# EAGLE design 44780_LCD-v1 (EAGLE 5.07)
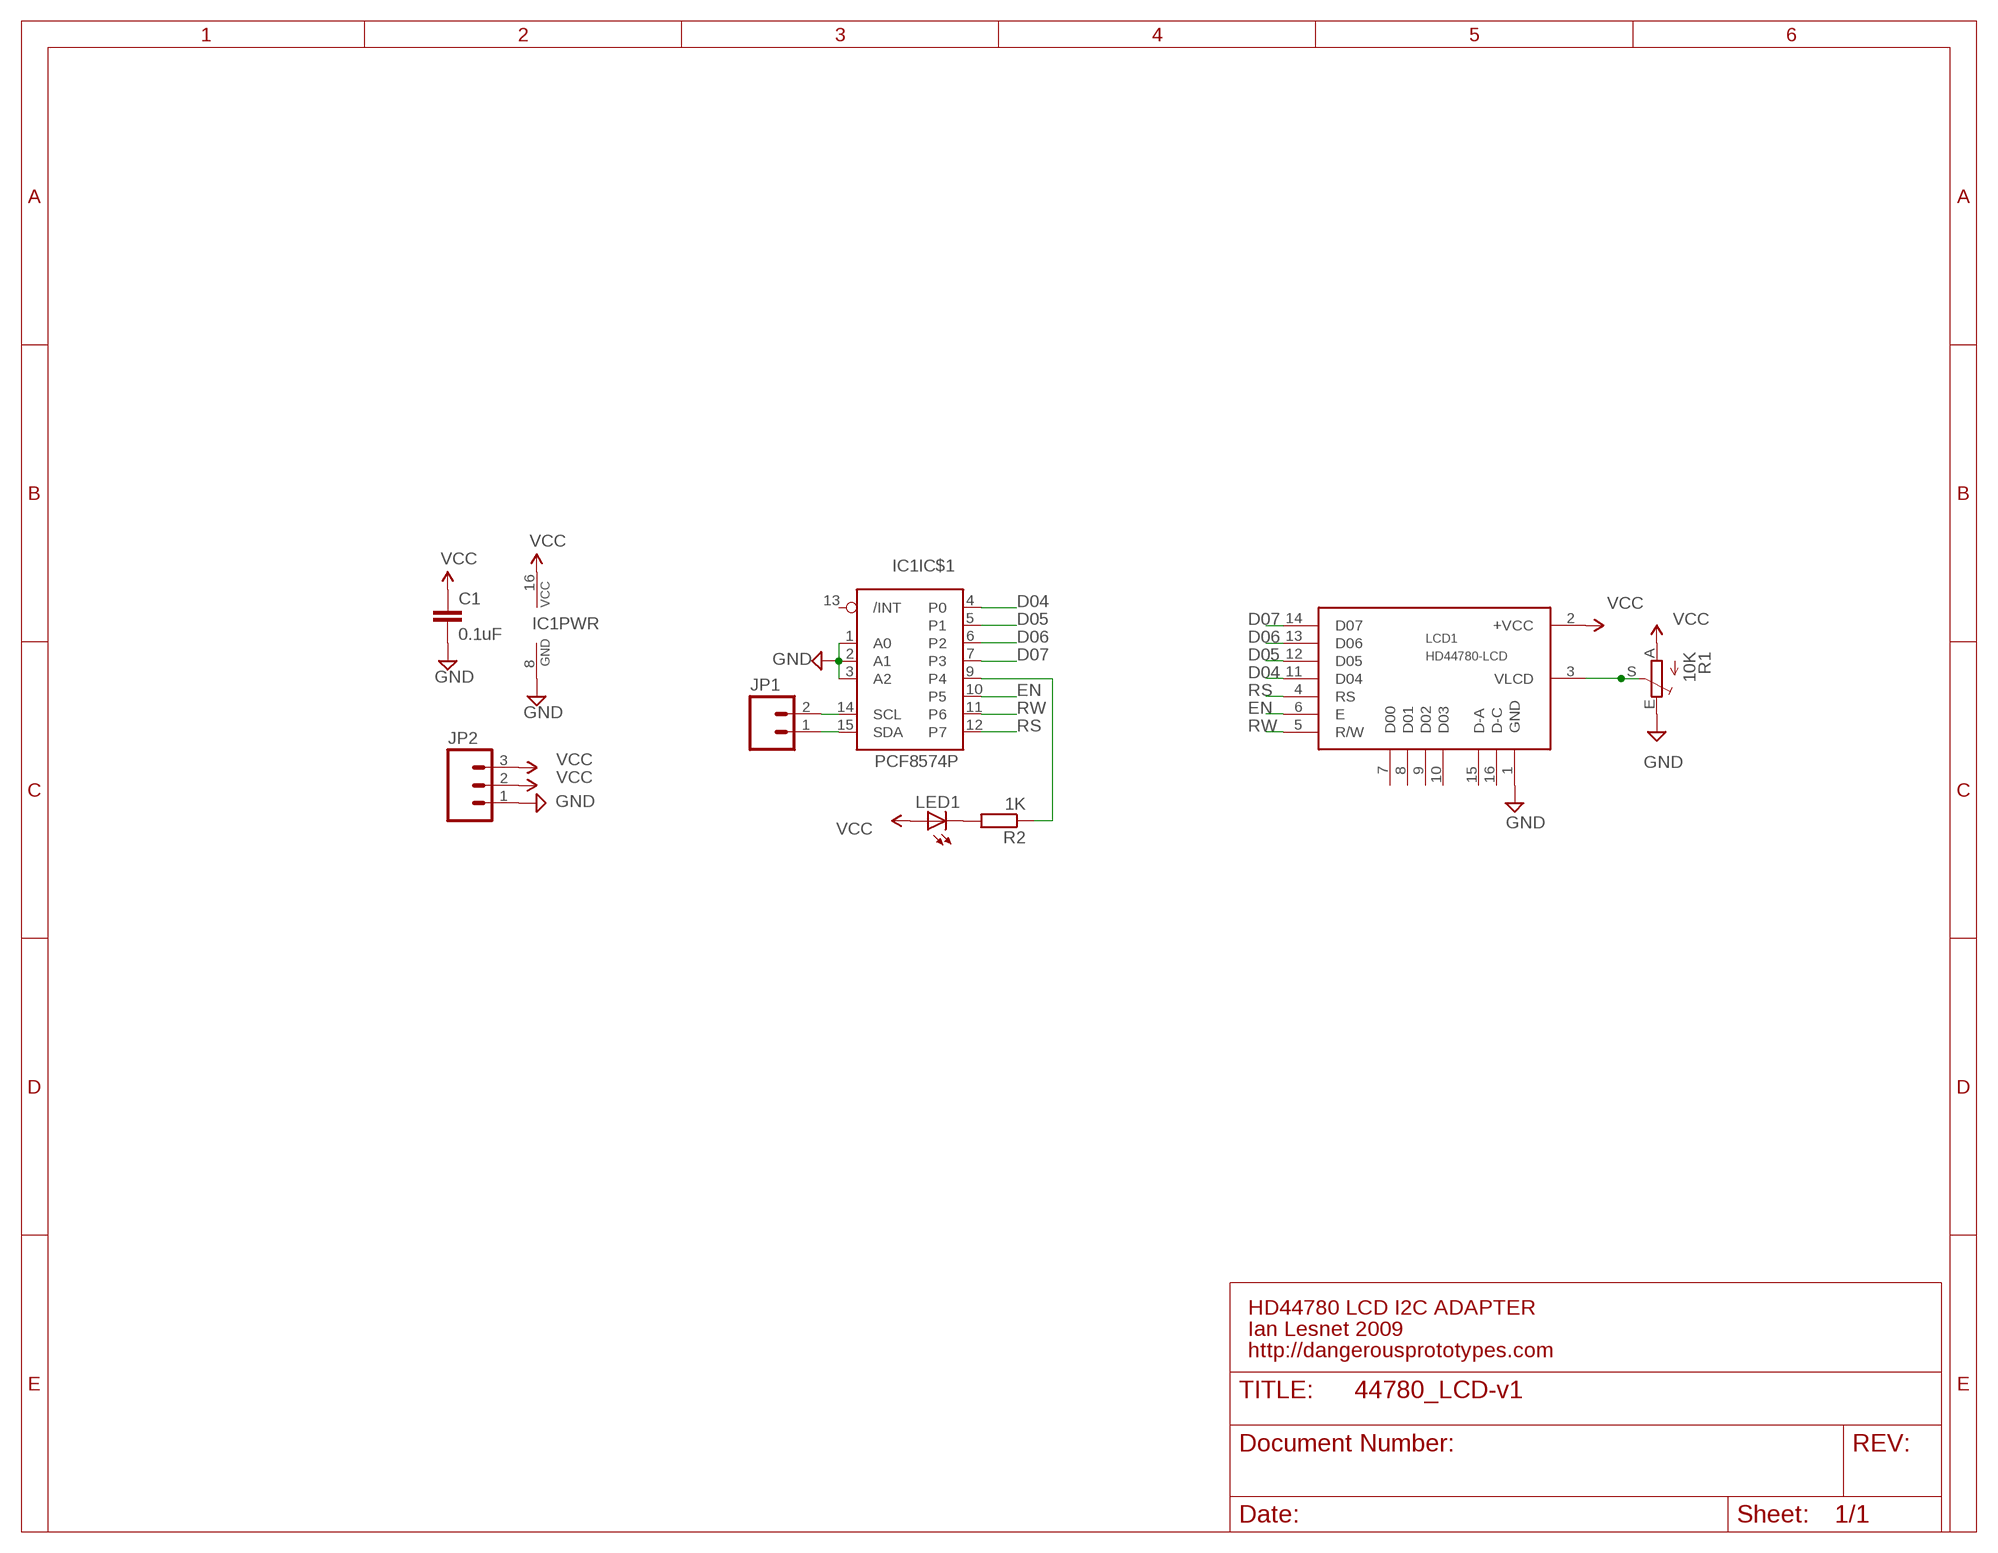
[diagram p0: schematic, sheet 1]

## Parts
C1  0.1uF  C-EU025-024X044  [C025-024X044]
IC1  PCF8574P  [DIL16]
JP1  M02PTH  [1X02]
JP2  M03PTH  [1X03]
LCD1  HD44780-LCD  [HD44780]
LED1  LED3MM  [LED3MM]
R1  10K  TRIM_EU-CA6V  [CA6V]
R2  1K  R-EU_0204/7  [0204/7]

## Nets
D04: IC1.4(IC$1:P0) LCD1.11(D04)
D05: IC1.5(IC$1:P1) LCD1.12(D05)
D06: IC1.6(IC$1:P2) LCD1.13(D06)
D07: IC1.7(IC$1:P3) LCD1.14(D07)
EN: IC1.10(IC$1:P5) LCD1.6(E)
GND: C1.2 IC1.1(IC$1:A0) IC1.2(IC$1:A1) IC1.3(IC$1:A2) IC1.8(PWR:GND) JP2.1 LCD1.1(GND) R1.E
N$8: IC1.14(IC$1:SCL) JP1.2
N$9: IC1.15(IC$1:SDA) JP1.1
N$10: LCD1.3(VLCD) R1.S
N$12: LED1.K(C) R2.2
N$13: IC1.9(IC$1:P4) R2.1
RS: IC1.12(IC$1:P7) LCD1.4(RS)
RW: IC1.11(IC$1:P6) LCD1.5(R/W)
VCC: C1.1 IC1.16(PWR:VCC) JP2.2 JP2.3 LCD1.2(+VCC) LED1.A R1.A
Unconnected: IC1.13(IC$1:/INT) LCD1.7(D00) LCD1.8(D01) LCD1.9(D02) LCD1.10(D03) LCD1.15(D-A) LCD1.16(D-C)

## Notes on the sheet
- HD44780 LCD I2C ADAPTER
- Ian Lesnet 2009
- http://dangerousprototypes.com

## Library data of the parts
C1 = rcl:C-EU: CAPACITOR, European symbol
IC1 = i2c:PCF8574: Remote 8-Bit I/O Expander for I²C Bus
JP1 = SparkFun:M02: Header 2 Standard 2-pin 0.1" header. Use with straight break away headers (SKU : PRT-00116), right angle break away headers (PRT-00553), swiss pins (PRT-00743), machine pins (PRT-00117), and female headers (PRT-00115). Molex polarized connector foot print use with SKU : PRT-08233 with associated crimp pins and housings.
JP2 = SparkFun:M03: Header 3 Standard 3-pin 0.1" header. Use with straight break away headers (SKU : PRT-00116), right angle break away headers (PRT-00553), swiss pins (PRT-00743), machine pins (PRT-00117), and female headers (PRT-00115). Molex polarized connector foot print use with SKU : PRT-08232 with associated crimp pins and housings.
LCD1 = lcd-hd44780:HD44780-LCD
LED1 = led:LED: LED OSRAM: - CHIPLED LG R971, LG N971, LY N971, LG Q971, LY Q971, LO R971, LY R971 LH N974, LH R974 LS Q976, LO Q976, LY Q976 LO Q996 - Hyper CHIPLED LW Q18S LB Q993, LB Q99A, LB R99A - SideLED LS A670, LO A670, LY A670, LG A670, LP A670 LB A673, LV A673, LT A673, LW A673 LH A674 LY A675 LS A676, LA A676, LO A676, LY A676, LW A676 LS A679, LY A679, LG A679 - Hyper Micro SIDELED® LS Y876, LA Y876, LO Y876, LY Y876 LT Y87S - SmartLED LW L88C, LW L88S LB L89C, LB L89S, LG L890 LS L89K, LO L89K, LY L89K LS L896, LA L896, LO L896, LY L896 - TOPLED LS T670, LO T670, LY T670, LG T670, LP T670 LSG T670, LSP T670, LSY T670, LOP T670, LYG T670 LG T671, LOG T671, LSG T671 LB T673, LV T673, LT T673, LW T673 LH T674 LS T676, LA T676, LO T676, LY T676, LB T676, LH T676, LSB T676, LW T676 LB T67C, LV T67C, LT T67C, LS T67K, LO T67K, LY T67K, LW E67C LS E67B, LA E67B, LO E67B, LY E67B, LB E67C, LV E67C, LT E67C LW T67C LS T679, LY T679, LG T679 LS T770, LO T770, LY T770, LG T770, LP T770 LB T773, LV T773, LT T773, LW T773 LH T774 LS E675, LA E675, LY E675, LS T675 LS T776, LA T776, LO T776, LY T776, LB T776 LHGB T686 LT T68C, LB T68C - Hyper Mini TOPLED® LB M676 - Mini TOPLED Santana® LG M470 LS M47K, LO M47K, LY M47K Source: http://www.osram.convergy.de LUXEON: - LUMILED® LXK2-PW12-R00, LXK2-PW12-S00, LXK2-PW14-U00, LXK2-PW14-V00 LXK2-PM12-R00, LXK2-PM12-S00, LXK2-PM14-U00 LXK2-PE12-Q00, LXK2-PE12-R00, LXK2-PE12-S00, LXK2-PE14-T00, LXK2-PE14-U00 LXK2-PB12-K00, LXK2-PB12-L00, LXK2-PB12-M00, LXK2-PB14-N00, LXK2-PB14-P00, LXK2-PB14-Q00 LXK2-PR12-L00, LXK2-PR12-M00, LXK2-PR14-Q00, LXK2-PR14-R00 LXK2-PD12-Q00, LXK2-PD12-R00, LXK2-PD12-S00 LXK2-PH12-R00, LXK2-PH12-S00 LXK2-PL12-P00, LXK2-PL12-Q00, LXK2-PL12-R00 Source: www.luxeon.com KINGBRIGHT: KA-3528ASYC Source: www.kingbright.com
R1 = pot:TRIM_EU-: POTENTIOMETER
R2 = rcl:R-EU_: RESISTOR, European symbol

## Board
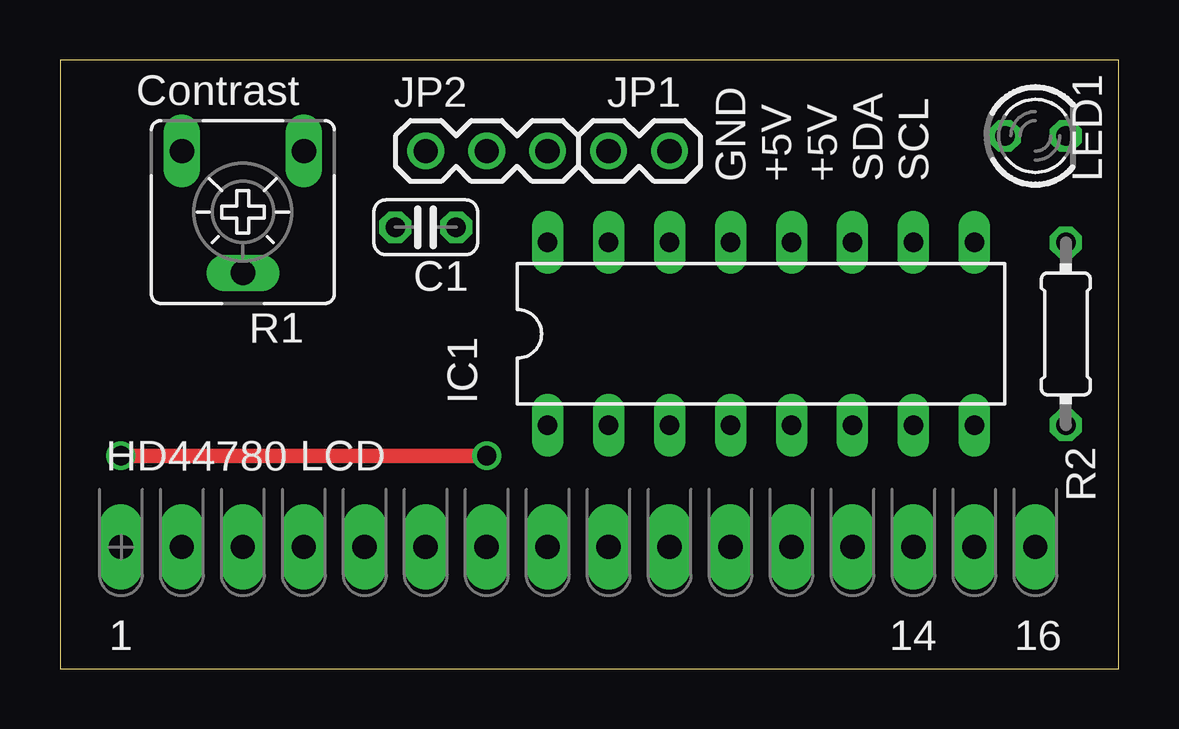
[diagram p1: board, top side]
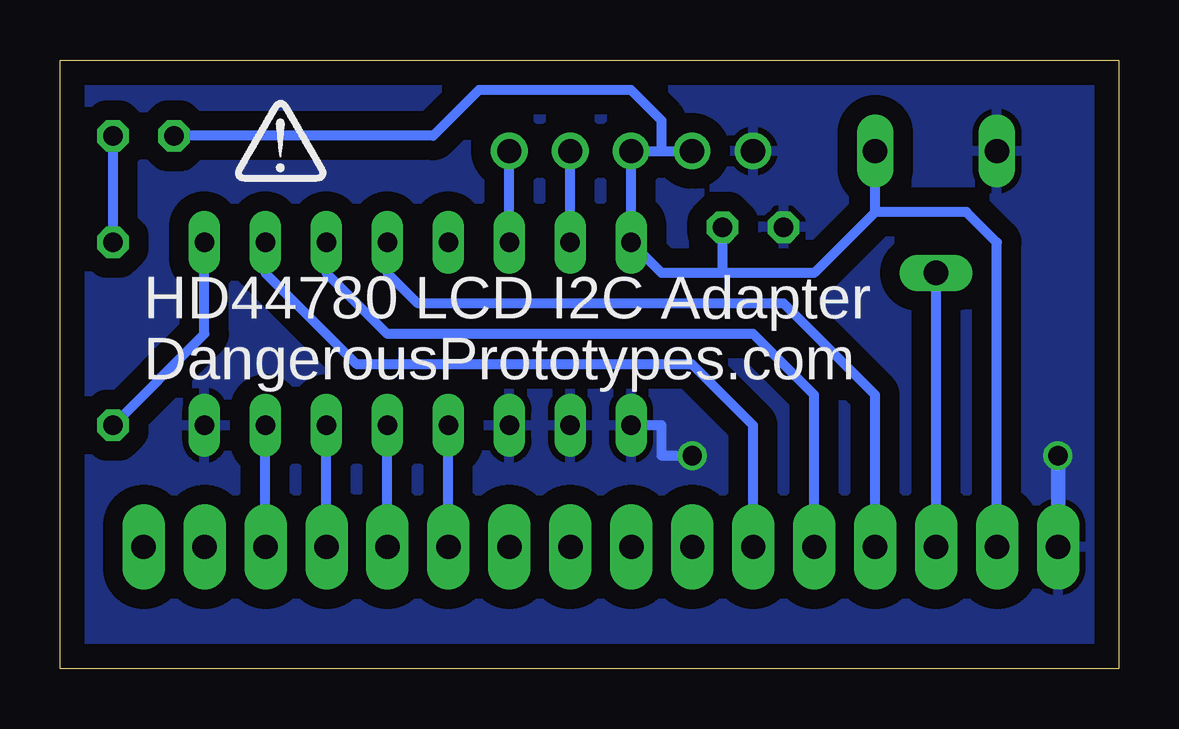
[diagram p2: board, bottom side, seen from below]

Size 44.12 x 25.39 mm. Coordinates in mm from the lower left corner, seen from the top.
Outline: 0,0 44.12,0 44.12,25.39 0,25.39 0,0
Copper layers (1*16): Top 0.035mm / dielectric 1.5mm / Bottom 0.035mm
Design rules "default": minimum track width 10mil, minimum drill 24mil, track to track 8mil, track to pad 8mil, pad to pad 8mil, via to via 8mil, smd to smd 8mil, copper to edge 40mil, drill to drill 8mil, minimum pad ring 10mil, minimum via ring 8mil, stop-mask expansion 4mil, vias tented up to drill 0mil, thermal gap 10mil

### Footprints (pad centres in the part's own frame; a part is rotated, then mirrored left to right if it is on the bottom)
C025-024X044 = drill 0.813 octagon: 1 -1.27,0; 2 1.27,0
DIL16 = drill 0.813 long: 1 -8.89,-3.81; 2 -6.35,-3.81; 3 -3.81,-3.81; 4 -1.27,-3.81; 5 1.27,-3.81; 6 3.81,-3.81; 7 6.35,-3.81; 8 8.89,-3.81; 9 8.89,3.81; 10 6.35,3.81; 11 3.81,3.81; 12 1.27,3.81; 13 -1.27,3.81; 14 -3.81,3.81; 15 -6.35,3.81; 16 -8.89,3.81
1X02 = drill 1.016 round: 1 0,0; 2 2.54,0
1X03 = drill 1.016 round: 1 0,0; 2 2.54,0; 3 5.08,0
HD44780 = drill 1.016 pad 1.778 long: 1 -20.325,0.007; 2 -17.785,0.007; 3 -15.245,0.007; 4 -12.705,0.007; 5 -10.165,0.007; 6 -7.625,0.007; 7 -5.085,0.007; 8 -2.545,0.007; 9 -0.005,0.007; 10 2.535,0.007; 11 5.075,0.007; 12 7.615,0.007; 13 10.155,0.007; 14 12.695,0.007; 15 15.235,0.007; 16 17.775,0.007
LED3MM = drill 0.813 octagon: A -1.27,0; K 1.27,0
CA6V = drill 1.016 long: A -2.54,-2.54; E 2.54,-2.54; S 0,2.54
0204/7 = drill 0.813 octagon: 1 -3.81,0; 2 3.81,0

### Placement (x,y rotation side)
C1  15.24,18.42 180 top
IC1  29.21,13.97 0 top
JP1  22.86,21.59 0 top
JP2  15.24,21.59 0 top
LCD1  22.86,5.08 0 top
LED1  40.64,22.22 0 top
R1  7.62,19.05 180 top
R2  41.91,13.97 90 top
U$1  [DP-LOGO-BOTTOM]  33.02,20.32 0 top

### Tracks (layer width: path | path; a pad name or v marks a point on that pad's centre or on a via)
D04
  Bottom 0.406: LCD1.11 27.94,4.32 | LCD1.11 IC1.4 | LCD1.11 | LCD1.11
D05
  Bottom 0.406: LCD1.12 30.48,4.32 | LCD1.12 IC1.5 | LCD1.12 | LCD1.12
D06
  Bottom 0.406: LCD1.13 33.02,4.32 | LCD1.13 IC1.6 | LCD1.13 | LCD1.13
D07
  Bottom 0.406: LCD1.14 35.56,4.32 | LCD1.14 IC1.7 | LCD1.14 | LCD1.14
EN
  Bottom 0.406: IC1.10 35.56,16.51 31.75,12.7 17.78,12.7 15.24,10.16 LCD1.6 | LCD1.6 15.24,3.81 | LCD1.6
GND  (via drill 0.8)
  Top 0.61: v2.54,8.89 v17.78,8.89
  Bottom 0.406: IC1.1 19.05,10.16 19.05,8.89 v17.78,8.89
  Bottom 0.61: v2.54,8.89 v2.53,8.89 LCD1.1
  pour Bottom (isolate 0.813): -1.27,24.13 43.18,24.13 43.18,0 -1.27,0
N$8
  Bottom 0.406: IC1.14 JP1.2
N$9
  Bottom 0.406: IC1.15 JP1.1
N$10
  Bottom 0.406: LCD1.3 R1.S
N$11
  pour Bottom (isolate 0.813): 0,25.4 44.45,25.4 44.45,0 0,0
N$12
  Bottom 0.406: R2.2 LED1.K
N$13
  Bottom 0.406: R2.1 38.1,13.97 IC1.9
RS
  Bottom 0.406: LCD1.4 10.16,11.43 13.97,15.24 29.21,15.24 30.48,16.51 IC1.12 | LCD1.4 | LCD1.4 10.16,4.32
RW
  Bottom 0.406: IC1.11 33.02,16.51 30.48,13.97 15.24,13.97 12.7,11.43 LCD1.5
VCC
  Bottom 0.406: LCD1.2 | LCD1.2 5.08,4.32 | 19.05,21.59 JP2.3 IC1.16 19.05,16.51 16.51,16.51 | 19.05,21.59 JP2.2 | LED1.A 28.57,22.22 26.67,24.13 20.32,24.13 19.05,22.86 19.05,21.59 | 10.16,19.05 R1.A | 16.51,16.51 12.7,16.51 10.16,19.05 | 16.51,16.51 C1.1 | LCD1.2 5.08,17.78 6.35,19.05 10.16,19.05

### Text on the board
tNames: Contrast | GND | +5V | +5V | SDA | SCL | HD44780 LCD
bNames: HD44780 LCD I2C Adapter | DangerousPrototypes.com
Reference: HD44780 LCD I2C ADAPTER | CC-0 | Ian Lesnet 2009 | http://dangerousprototypes.com